# EAGLE design sirius1 (EAGLE 9.6.2)
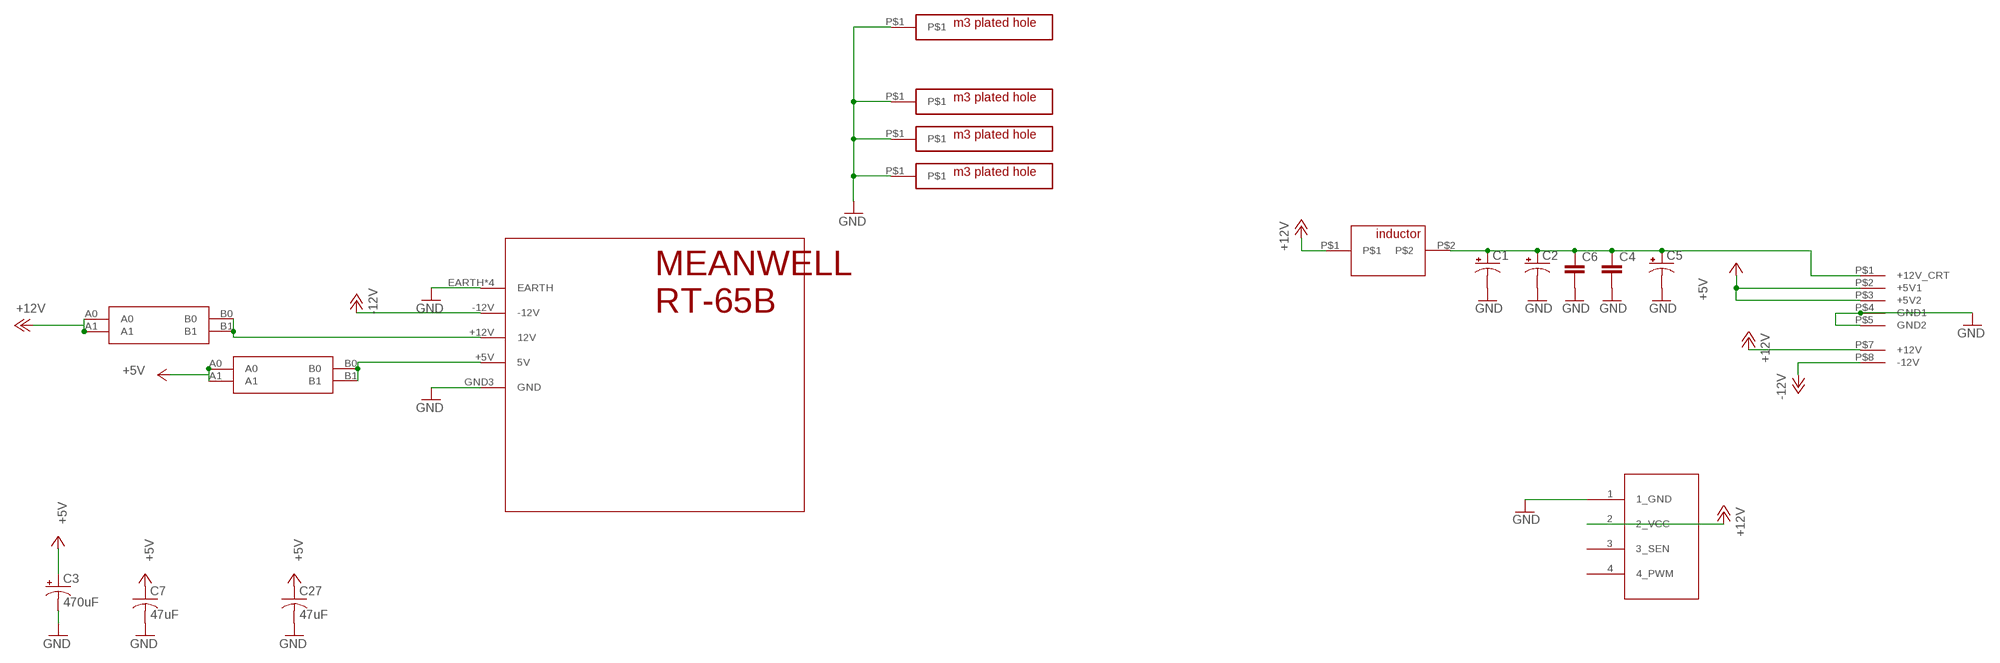
[diagram p0: schematic, sheet 1]

## Parts
C1  CPOL-USE3.5-8  [E3,5-8]
C2  CPOL-USE3.5-8  [E3,5-8]
C3  470uF  CPOL-USSMCD  [SMC_D]
C4  C5/2.5  [C5B2.5]
C5  CPOL-USE3.5-8  [E3,5-8]
C6  C5/2.5  [C5B2.5]
C7  47uF  C-USC1210  [C1210]
C27  47uF  C-USC1210  [C1210]
JP4  4PIN_FAN  [1X04]
U$1  M3_HOLE_PLATEDM3  [M3_HOLE_PLATED]
U$2  M3_HOLE_PLATEDM3  [M3_HOLE_PLATED]
U$4  M3_HOLE_PLATEDM3  [M3_HOLE_PLATED]
U$5  M3_HOLE_PLATEDM3  [M3_HOLE_PLATED]
U$6  396_SIRIUS1  [396_SIRIUS1]
U$7  MEANWELL_RT65  [MEANWELL_RT65]
U$8  CAR_FUSE_HOLDER3IN1  [FUSE_HOLDER_3IN1]
U$9  CAR_FUSE_HOLDER3IN1  [FUSE_HOLDER_3IN1]
U$10  INDUCTOR_PTH_8MM  [INDUCTOR_PTH_8MM]

## Nets
+5V: C3.+ C7.1 C27.1 U$6.P$2(+5V1) U$6.P$3(+5V2) U$8.A0 U$8.A1
+12V: JP4.2(2_VCC) U$6.P$7(+12V) U$9.A0 U$9.A1 U$10.P$1
-12V: U$6.P$8(-12V) U$7.-12V
GND: C1.- C2.- C3.- C4.2 C5.- C6.2 C7.2 C27.2 JP4.1(1_GND) U$1.P$1 U$2.P$1 U$4.P$1 U$5.P$1 U$6.P$4(GND1) U$6.P$5(GND2) U$7.EARTH U$7.GND1(EARTH) U$7.GND2(EARTH) U$7.GND3(GND) U$7.GND(EARTH)
N$1: C1.+ C2.+ C4.1 C5.+ C6.1 U$6.P$1(+12V_CRT) U$10.P$2
N$2: U$7.+5V(5V) U$8.B0 U$8.B1
N$4: U$7.+12V(12V) U$9.B0 U$9.B1
Unconnected: JP4.3(3_SEN) JP4.4(4_PWM)

## Library data of the parts
C1 C2 C5 = adafruit_changed:CPOL-US: POLARIZED CAPACITOR, American symbol
C3 = rcl:CPOL-US: POLARIZED CAPACITOR, American symbol; SPICEPREFIX: C
C4 C6 = capacitor-wima:C: CAPACITOR naming: grid - package width
C7 C27 = clock:C-US: CAPACITOR, American symbol
JP4 = appleii:4PIN_FAN: PIN HEADER
U$1 U$2 U$4 U$5 = os1:M3_HOLE_PLATED
U$6 = 396_conn:396_SIRIUS1
U$7 = os1:MEANWELL_RT65
U$8 U$9 = atx_power_control:CAR_FUSE_HOLDER
U$10 = 396_conn:INDUCTOR_PTH_8MM

## Board
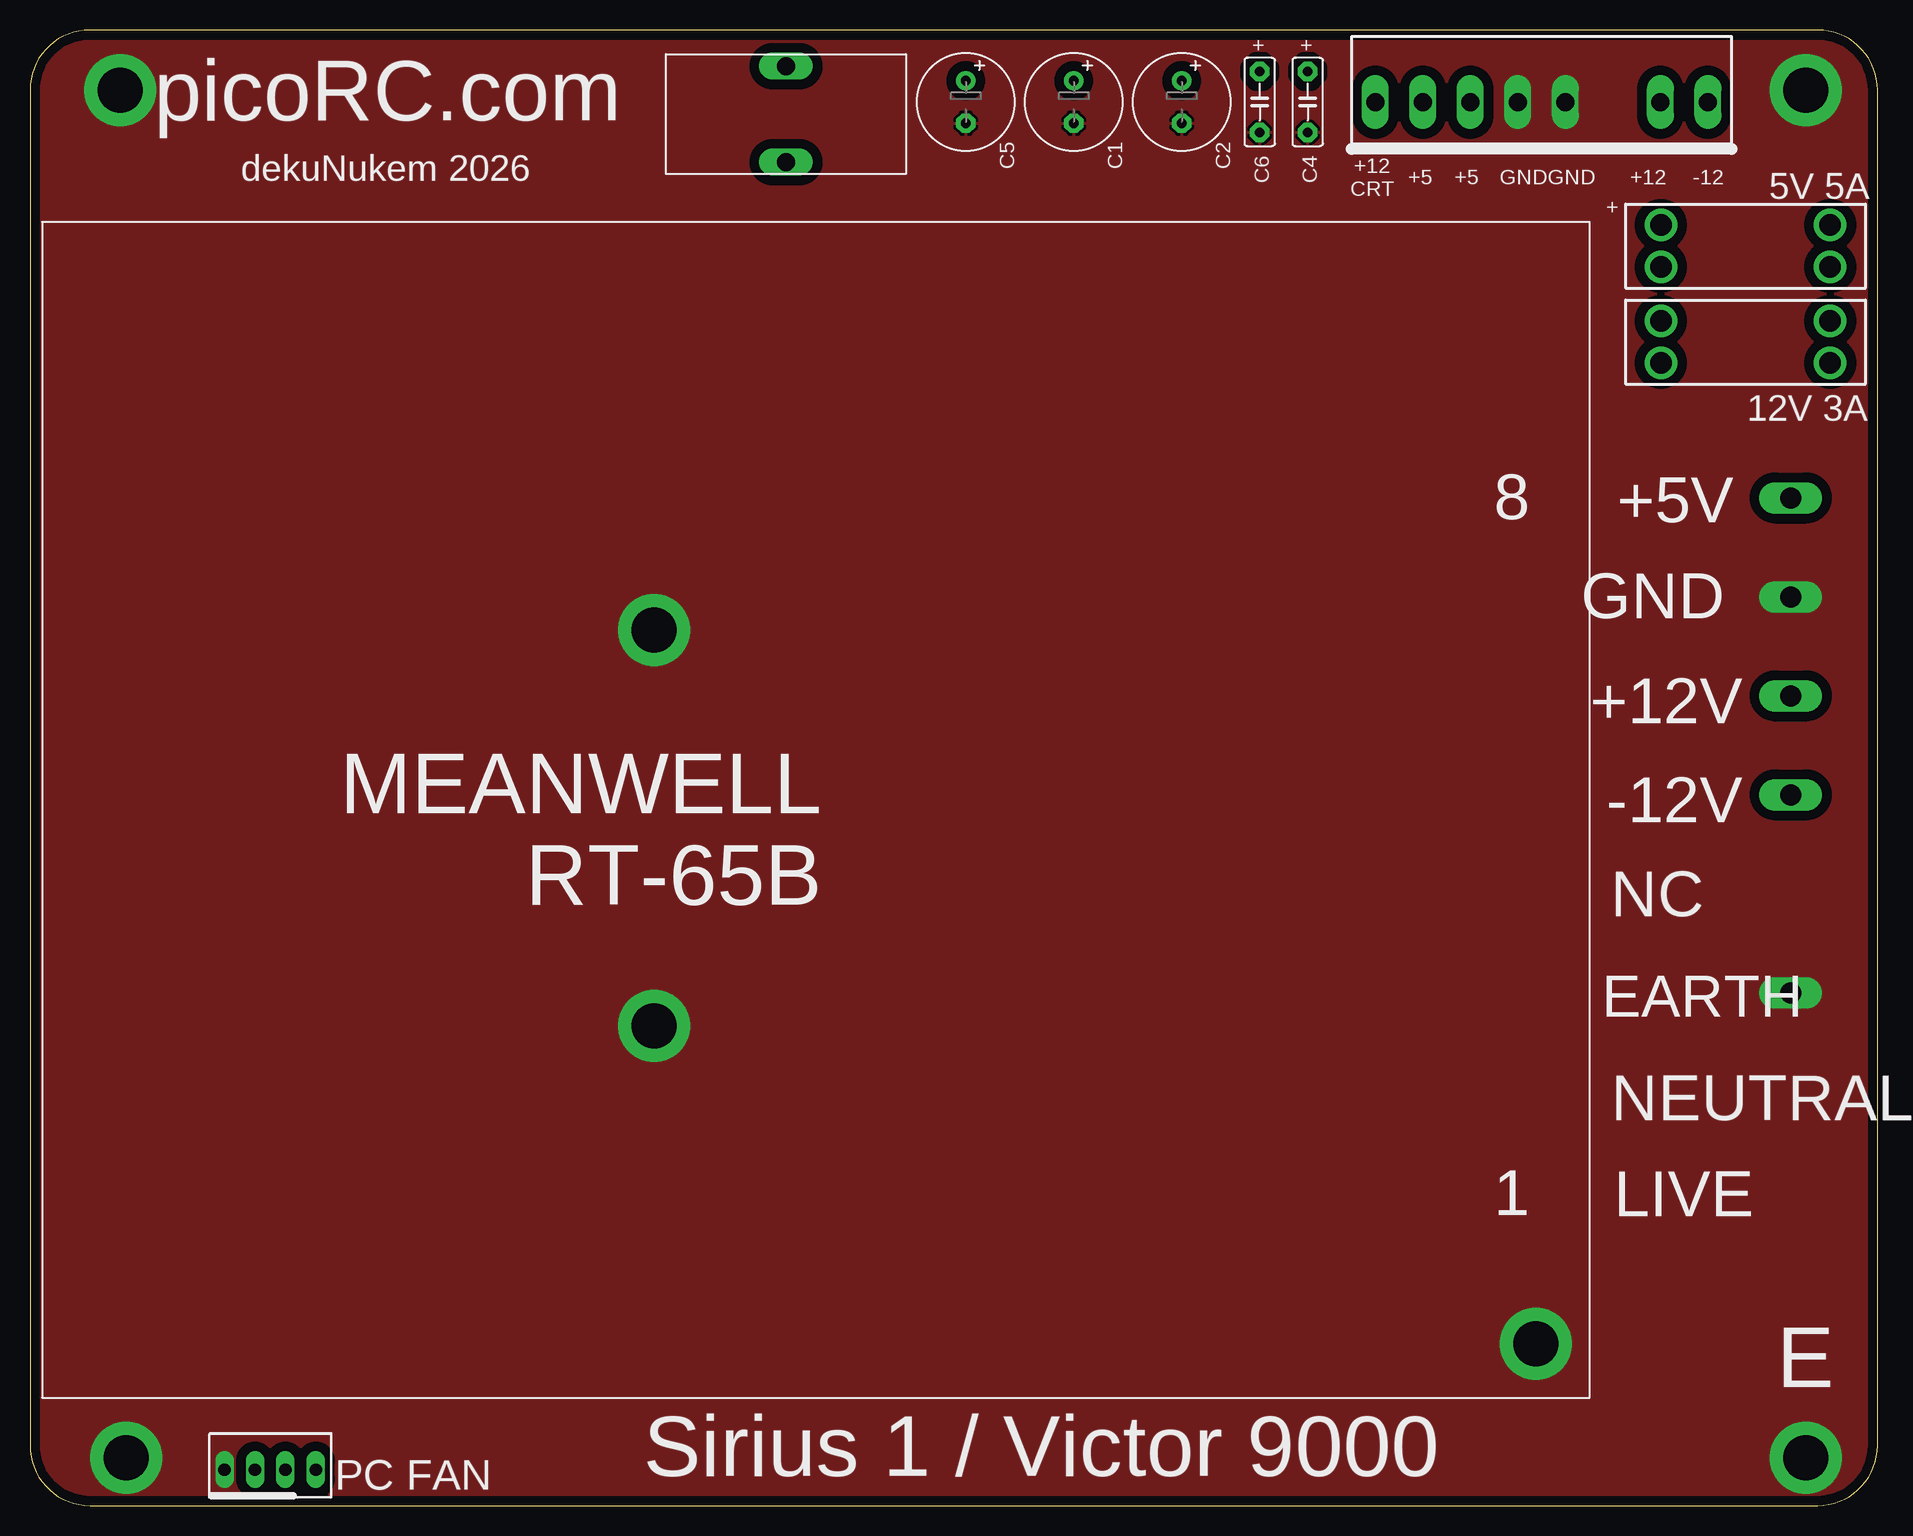
[diagram p1: board, top side]
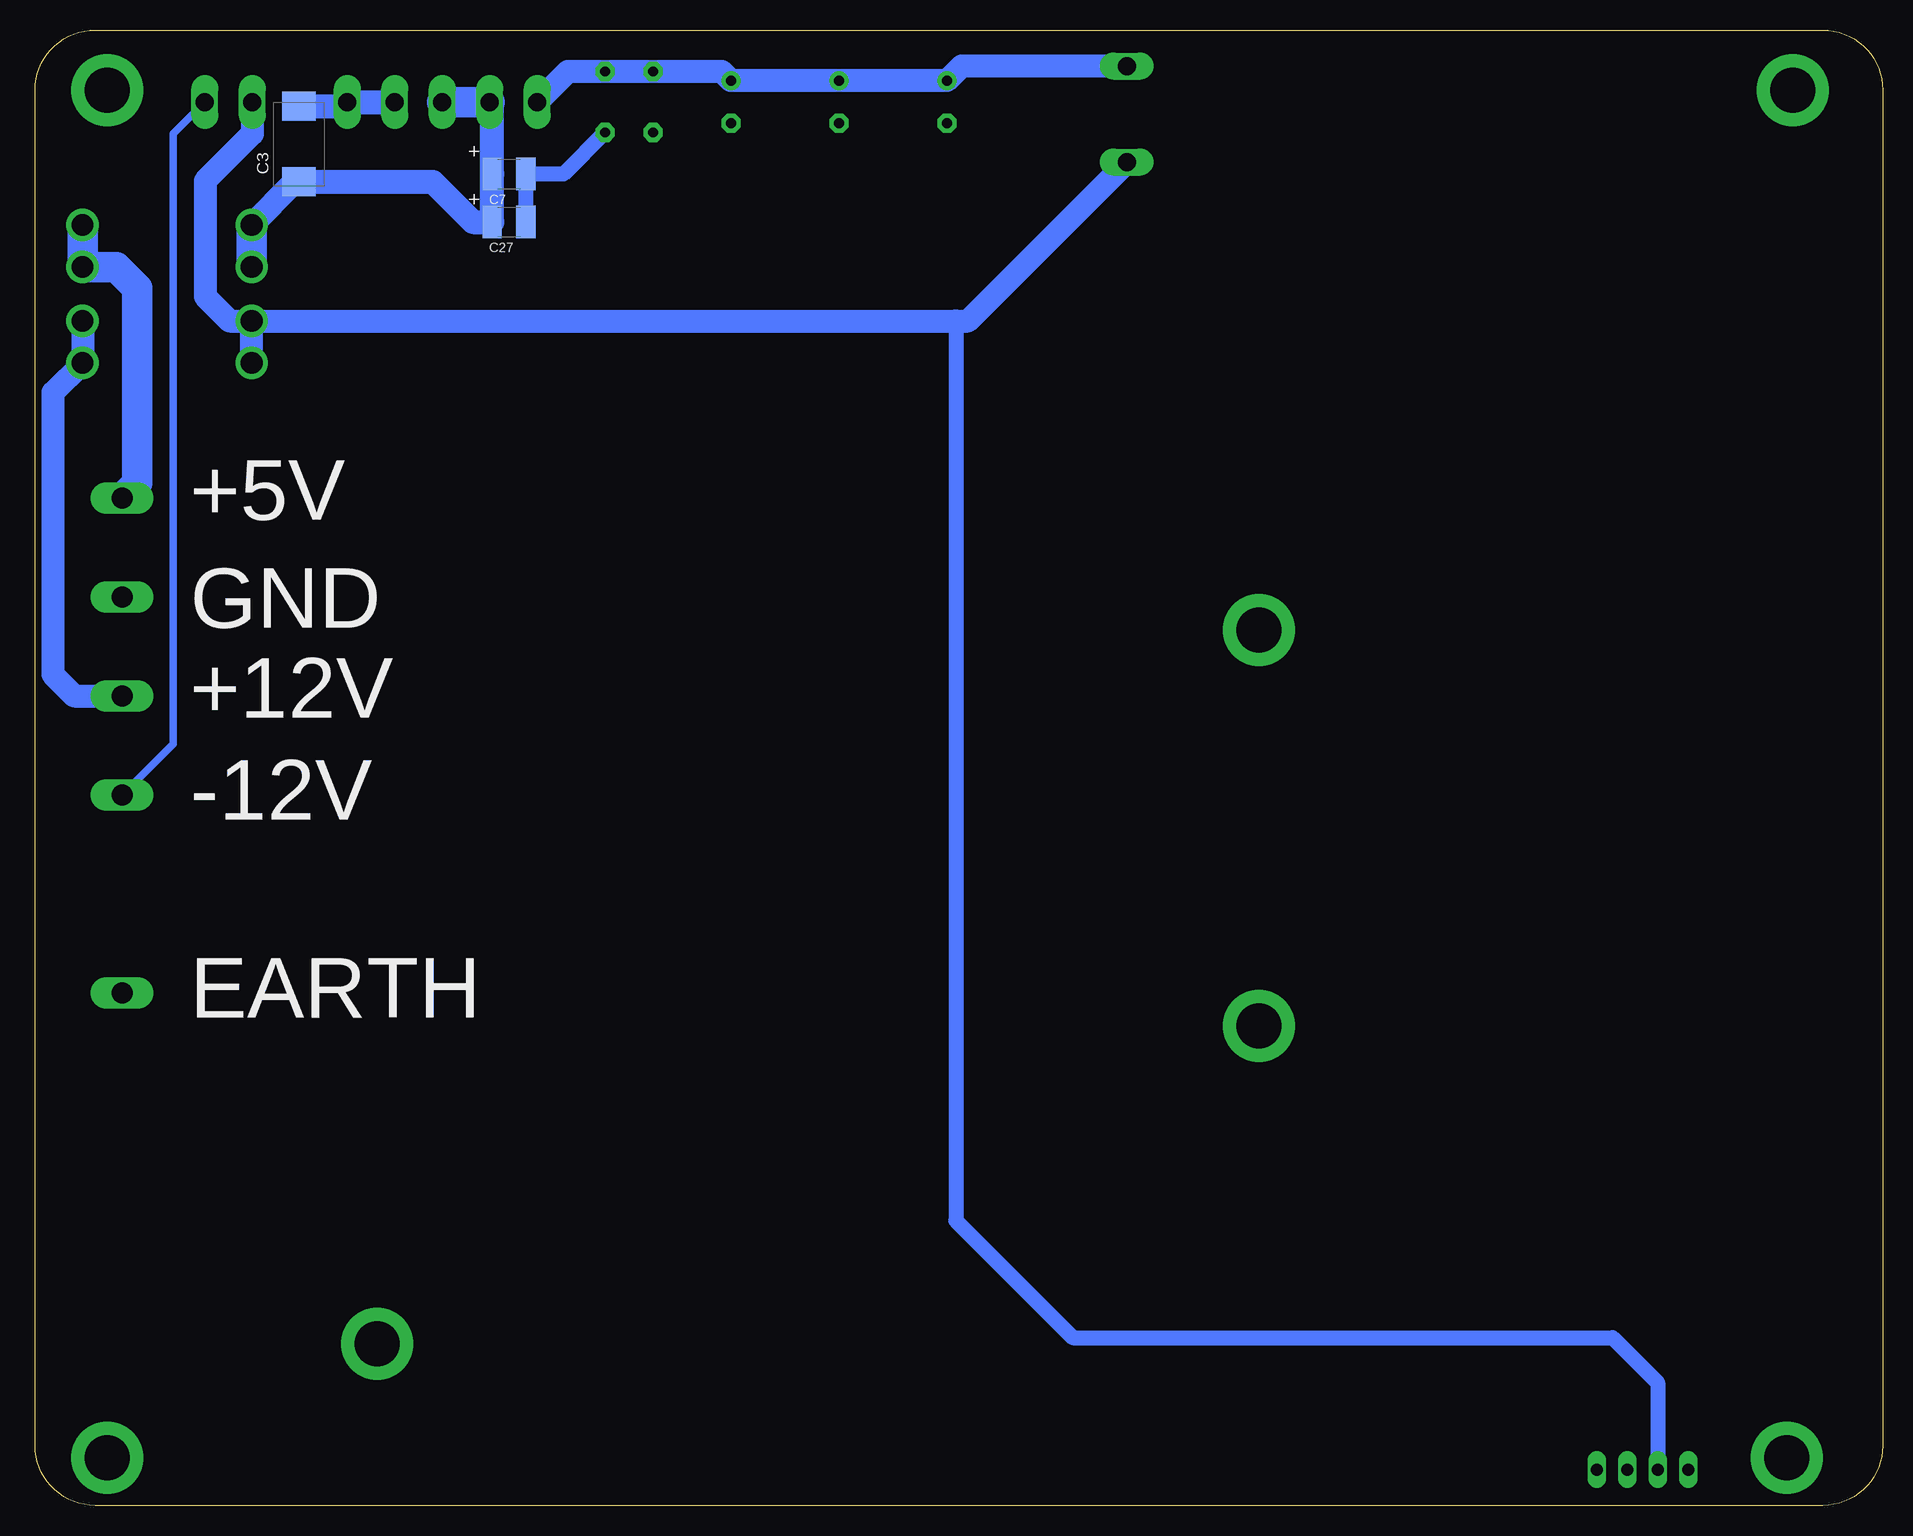
[diagram p2: board, bottom side, seen from below]

Size 154 x 123 mm. Coordinates in mm from the lower left corner, seen from the top.
Outline: 0,118 0,5 arc90 5,0 149,0 arc90 154,5 154,118 arc90 149,123 5,123 arc90 0,118
Copper layers (1*16): Top 0.035mm / dielectric 1.5mm / Bottom 0.035mm
Design rules "deku_2layer_6mil *": minimum track width 6mil, minimum drill 15mil, track to track 20mil, track to pad 6mil, pad to pad 6mil, via to via 6mil, smd to smd 6mil, copper to edge 10mil, drill to drill 6mil, minimum pad ring 7mil, minimum via ring 7mil, stop-mask expansion 4mil, vias tented up to drill 25mil, thermal gap 10mil

### Footprints (pad centres in the part's own frame; a part is rotated, then mirrored left to right if it is on the bottom)
E3,5-8 = drill 0.813 pad 1.6: + -1.778,0 | drill 0.813 pad 1.6 octagon: - 1.778,0
SMC_D = smd 2.4 x 2.8: + -3.15,0; - 3.15,0
C5B2.5 = drill 0.813 pad 1.6 octagon: 1 -2.54,0; 2 2.54,0
C1210 = smd 1.6 x 2.7: 1 -1.4,0; 2 1.4,0
1X04 = drill 1.016 long: 1 -3.81,0; 2 -1.27,0; 3 1.27,0; 4 3.81,0
M3_HOLE_PLATED = drill 3.75 pad 6: P$1 0,0
396_SIRIUS1 = drill 1.5 long: P$1 -13.86,0; P$2 -9.9,0; P$3 -5.94,0; P$4 -1.98,0; P$5 1.98,0; P$7 9.9,0; P$8 13.86,0
MEANWELL_RT65 = drill 1.75 long: +5V -16.75,23; +12V -16.75,39.5; -12V -16.75,47.75; EARTH -16.75,64.25; GND -16.75,31.25 | drill 3.75 pad 6: GND1 4.5,93.5; GND2 78,67; GND3 78,34
FUSE_HOLDER_3IN1 = drill 1.8: A0 -7.05,1.75; A1 -7.05,-1.75; B0 7.05,1.75; B1 7.05,-1.75
INDUCTOR_PTH_8MM = drill 1.5 long: P$1 -4,0; P$2 4,0

### Placement (x,y rotation side)
C1  87,117 270 top
C2  96,117 270 top
C3  132,113.5 90 bottom
C4  106.5,117 270 top
C5  78,117 270 top
C6  102.5,117 270 top
C7  114.5,111 0 bottom
C27  114.5,107 0 bottom
JP4  20.02,2.99 0 top
U$1  148,4 0 bottom
U$2  8,4 0 bottom
U$4  148,118 0 bottom
U$5  7.5,118 0 bottom
U$6  126,117 0 top
U$7  130,107 180 top
U$8  143,105 0 top
U$9  143,97 0 top
U$10  63,116 90 top

### Tracks (layer width: path | path; a pad name or v marks a point on that pad's centre or on a via)
+5V
  Bottom 2: U$6.P$2 115.9,116.8 C7.1 C27.1 117.5,107 120.85,110.35 C3.+ 132.35,110.35 U$8.A0
  Bottom 2.54: U$8.A1 U$8.A0 | U$6.P$3 U$6.P$2
+12V
  Bottom 1.27: 77.25,98.75 77.25,23.75 67.5,14 22.5,14 18.75,10.25 JP4.2
  Bottom 1.905: U$9.A1 U$9.A0 | U$9.A0 77.25,98.75 76.25,98.75 U$10.P$1 | U$6.P$7 135.9,114.35 139.83,110.43 139.83,100.77 137.8,98.75 U$9.A0
-12V
  Bottom 0.61: U$7.-12V 142.5,63.5 142.5,114.36 U$6.P$8
GND
  Bottom 1.27: C4.2 109.96,111 C7.2 C27.2
  Bottom 2: C3.- 128.33,116.65 U$6.P$5 U$6.P$4
  pour Top (isolate 0.813): -73.5,190 -73.5,-37 283,-37 283,190
  pour Top (no thermals): 143,78.46 151,78.46 151,72.46 143,72.46
  pour Top (no thermals): 142.5,45 150.5,45 150.5,40 142.5,40
N$1
  Bottom 1.905: U$10.P$2 76.78,120 C5.+ C1.+ C2.+ 96.76,119.54 C6.1 C4.1 109.6,119.54 U$6.P$1
N$2
  Bottom 2.54: U$7.+5V 145.5,85.25 145.5,101.5 147.25,103.25 U$8.B1 U$8.B0
N$4
  Bottom 1.905: U$9.B0 U$9.B1 152.53,92.77 152.53,69.28 150.75,67.5 U$7.+12V

### Text on the board
tNames: + | + | picoRC.com | dekuNukem 2026 | +12 / CRT | +5 | +5 | GND | GND | +12 | -12 | 5V 5A | + | 12V 3A | E | Sirius 1 / Victor 9000 | PC FAN
bNames: +5V | GND | +12V | -12V | EARTH